# Altium schematic sheet MDL_CONTROL.SchDoc: CONCENTRADOR 2.0
size A3
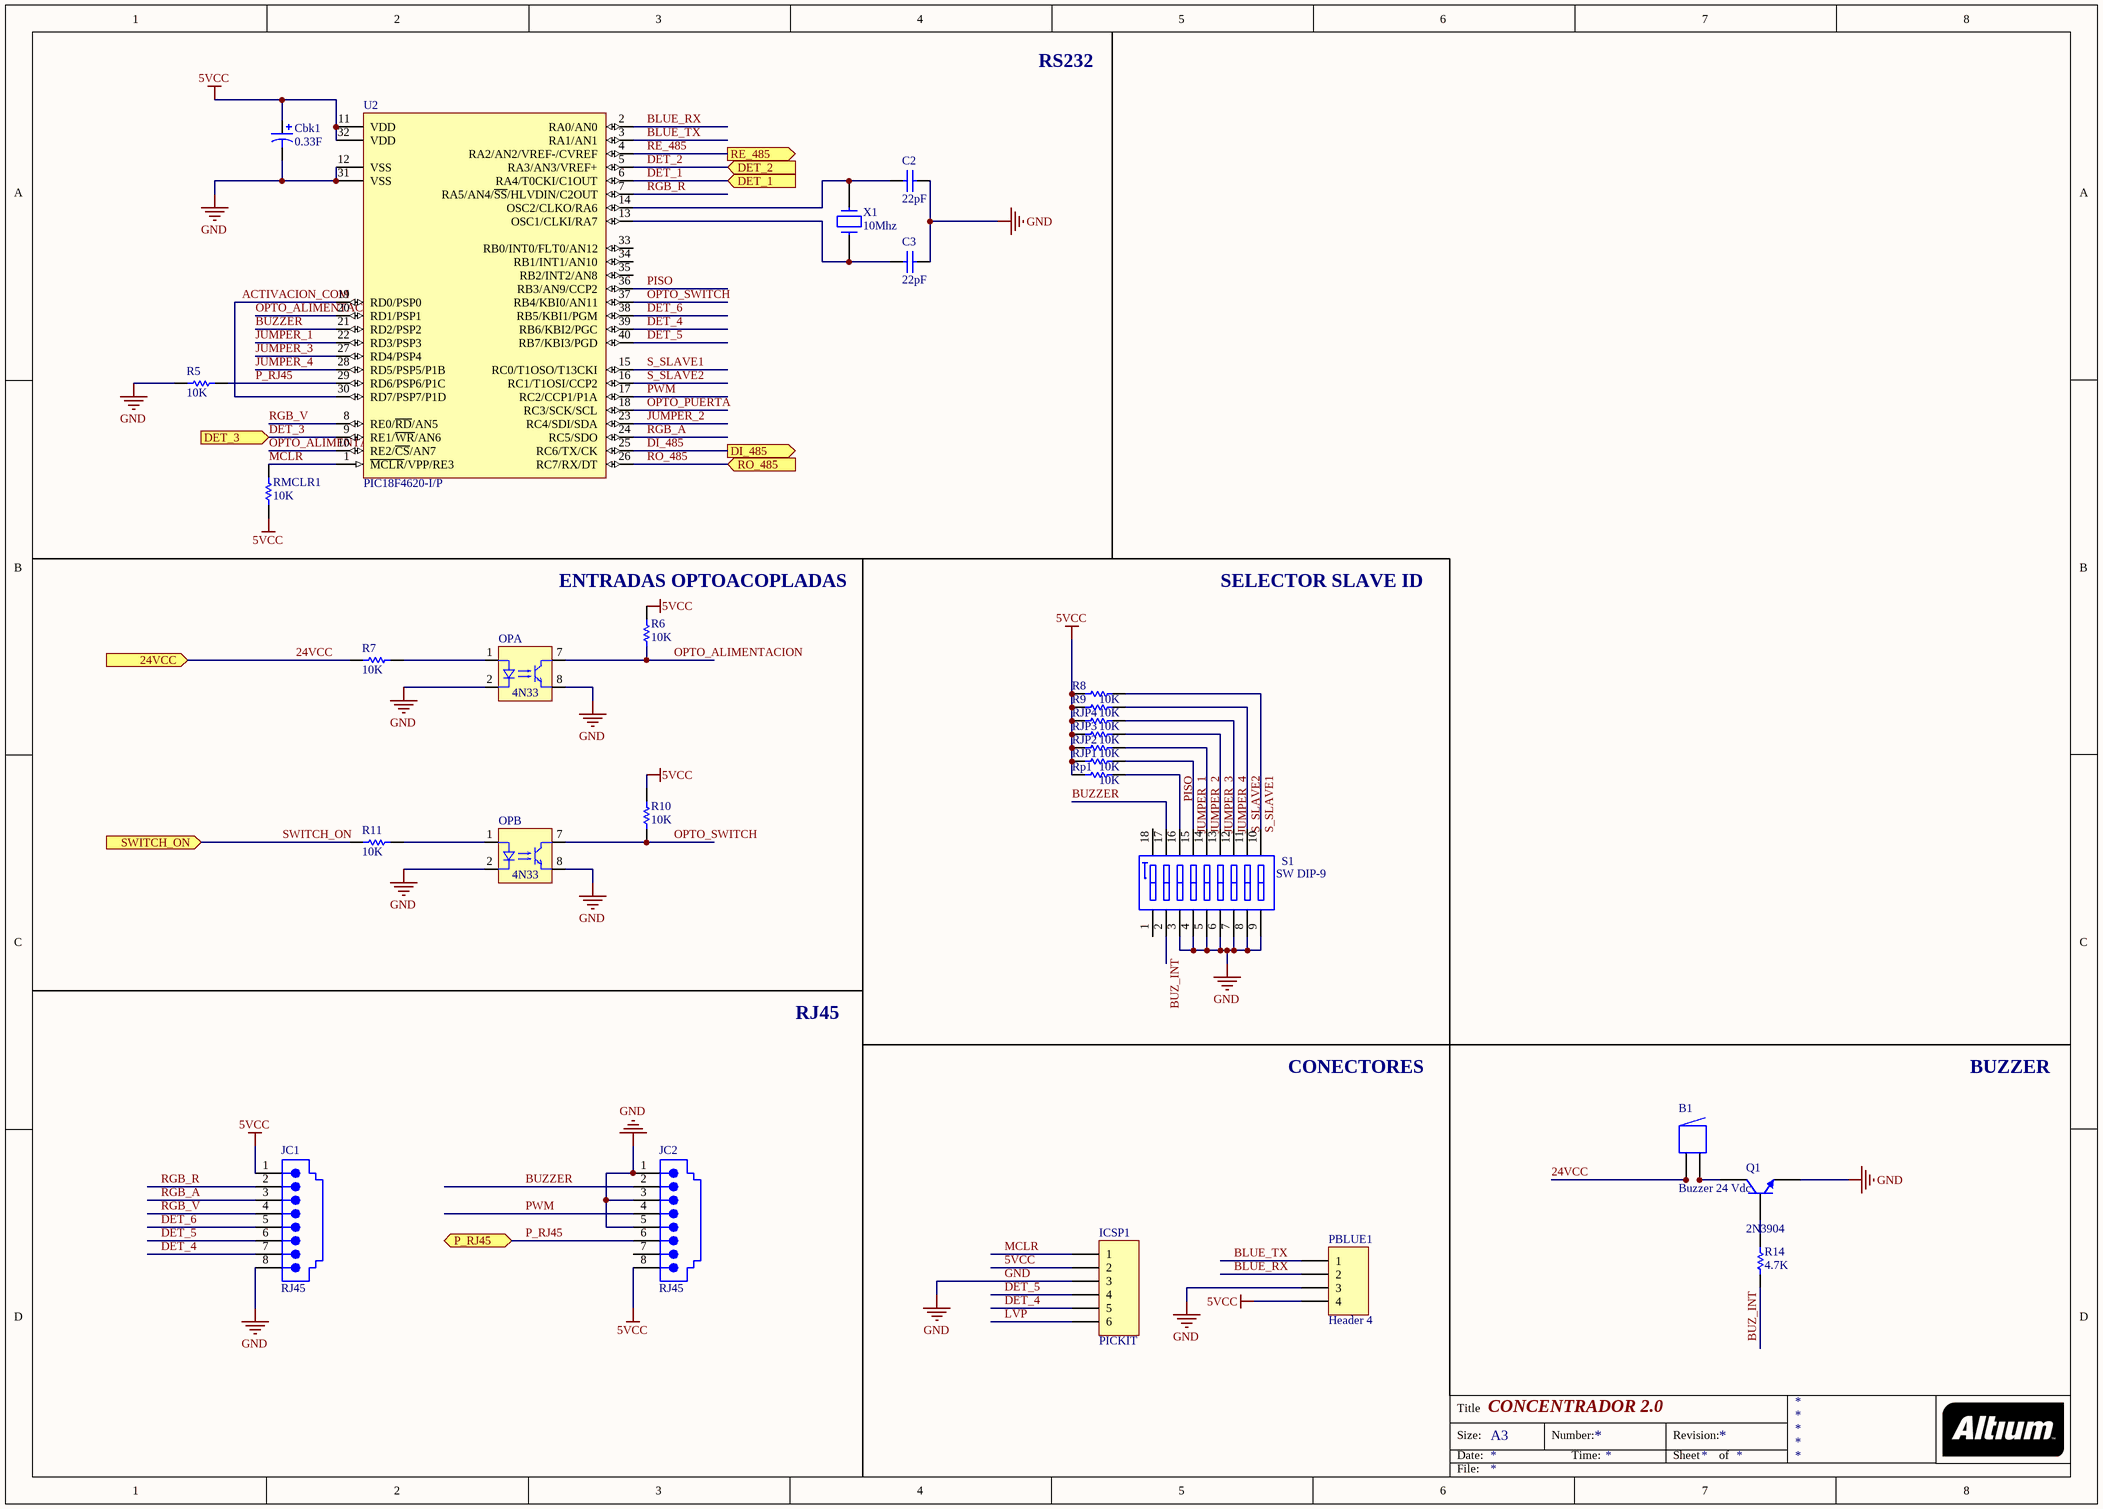
[diagram p0: MDL_CONTROL.SchDoc]

## Parts
B1  Buzzer 24 Vdc  [ABSM-1574]
C2  value 22pF  [VP31-2.5]  (hidden comment: VP31BA220JB)
C3  value 22pF  [VP31-2.5]  (hidden comment: VP31BA220JB)
Cbk1  value 0.33F  [C1000UF]  (hidden comment: Cap Pol1)
ICSP1  PICKIT  [HDR1X6]
JC1  RJ45  [15-43-6233]
JC2  RJ45  [15-43-6233]
OP  4N33  [4n35_4n33_6pines]  (parts A,B of 2)
PBLUE1  Header 4  [HDR1X4]
Q1  2N3904  [TO-92A]
R5  value 10K  [AXIAL-0.3]  (hidden comment: Res)
R6  value 10K  [AXIAL-0.3]  (hidden comment: Res)
R7  value 10K  [AXIAL-0.3]  (hidden comment: Res)
R8  value 10K  [AXIAL-0.3]  (hidden comment: Res)
R9  value 10K  [AXIAL-0.3]  (hidden comment: Res)
R10  value 10K  [AXIAL-0.3]  (hidden comment: Res)
R11  value 10K  [AXIAL-0.3]  (hidden comment: Res)
R14  value 4.7K  [AXIAL-0.3]  (hidden comment: Res)
RJP1  value 10K  [AXIAL-0.3]  (hidden comment: Res)
RJP2  value 10K  [AXIAL-0.3]  (hidden comment: Res)
RJP3  value 10K  [AXIAL-0.3]  (hidden comment: Res)
RJP4  value 10K  [AXIAL-0.3]  (hidden comment: Res)
RMCLR1  value 10K  [AXIAL-0.3]  (hidden comment: Res)
Rp1  value 10K  [AXIAL-0.3]  (hidden comment: Res)
S1  SW DIP-9  [DIP-18]
U2  PIC18F4620-I/P  [PDIP600-P40]
X1  10Mhz  [XTAL-1]

## Ports
24VCC (in), DET_1 (in), DET_2 (in), DET_3 (in), DI_485 (out), P_RJ45 (bidir), RE_485 (out), RO_485 (in), SWITCH_ON (in)

## Nets
5VCC: Cbk1.1 ICSP1.2 JC1.1 JC2.8 PBLUE1.4 R6.2 R8.2 R9.2 R10.2 RJP1.2 RJP2.2 RJP3.2 RJP4.2 RMCLR1.2 Rp1.2 U2.11(VDD) U2.32(VDD)
GND: C2.2 C3.1 Cbk1.2 ICSP1.3 JC1.8 JC2.1 JC2.3 JC2.5 OP.2(K) OP.8(E) PBLUE1.3 Q1.1(E) R5.2 S1.3(A3) S1.4(A4) S1.5(A5) S1.6(A6) S1.7(A7) S1.8(A8) S1.9(A9) U2.12(VSS) U2.31(VSS)
24VCC: B1.1 B1.1A R7.1 ; port 24VCC
ACTIVACION_COM: U2.19(RD0/PSP0) U2.30(RD7/PSP7/P1D)
BLUE_RX: PBLUE1.2 U2.2(RA0/AN0)
BLUE_TX: PBLUE1.1 U2.3(RA1/AN1)
BUZ_INT: R14.1 S1.2(A2)
BUZZER: JC2.2 S1.17(B2) U2.21(RD2/PSP2)
DET_1: U2.6(RA4/T0CKI/C1OUT) ; port DET_1
DET_2: U2.5(RA3/AN3/VREF+) ; port DET_2
DET_3: U2.9(RE1/~{WR}/AN6) ; port DET_3
DET_4: ICSP1.5 JC1.7 U2.39(RB6/KBI2/PGC)
DET_5: ICSP1.4 JC1.6 U2.40(RB7/KBI3/PGD)
DET_6: JC1.5 U2.38(RB5/KBI1/PGM)
DI_485: U2.25(RC6/TX/CK) ; port DI_485
JUMPER_1: RJP1.1 S1.15(B4) U2.22(RD3/PSP3)
JUMPER_2: RJP2.1 S1.14(B5) U2.23(RC4/SDI/SDA)
JUMPER_3: RJP3.1 S1.13(B6) U2.27(RD4/PSP4)
JUMPER_4: RJP4.1 S1.12(B7) U2.28(RD5/PSP5/P1B)
LVP: ICSP1.6
MCLR: ICSP1.1 RMCLR1.1 U2.1(~{MCLR}/VPP/RE3)
OPTO_ALIMENTACION: OP.7(C) R6.1 U2.10(RE2/~{CS}/AN7) U2.20(RD1/PSP1)
OPTO_PUERTA: U2.18(RC3/SCK/SCL)
OPTO_SWITCH: OP.7(C) R10.1 U2.37(RB4/KBI0/AN11)
P_RJ45: JC2.6 R5.1 U2.29(RD6/PSP6/P1C) ; port P_RJ45
PISO: Rp1.1 S1.16(B3) U2.36(RB3/AN9/CCP2)
PWM: JC2.4 U2.17(RC2/CCP1/P1A)
RE_485: U2.4(RA2/AN2/VREF-/CVREF) ; port RE_485
RGB_A: JC1.3 U2.24(RC5/SDO)
RGB_R: JC1.2 U2.7(RA5/AN4/~{SS}/HLVDIN/C2OUT)
RGB_V: JC1.4 U2.8(RE0/~{RD}/AN5)
RO_485: U2.26(RC7/RX/DT) ; port RO_485
S_SLAVE1: R8.1 S1.10(B9) U2.15(RC0/T1OSO/T13CKI)
S_SLAVE2: R9.1 S1.11(B8) U2.16(RC1/T1OSI/CCP2)
SWITCH_ON: R11.1 ; port SWITCH_ON
NetB1_2: B1.2 B1.2A Q1.3(C)
NetC2_1: C2.1 U2.14(OSC2/CLKO/RA6) X1.1
NetC3_2: C3.2 U2.13(OSC1/CLKI/RA7) X1.2
NetOP_1: OP.1(A) R7.2
NetOP_1: OP.1(A) R11.2  [a separate net that carries the same name]
NetQ1_2: Q1.2(B) R14.2

Not connected (* = marked no-connect by the designer): JC2 7; S1 1(A1) 18(B1); U2 33(RB0/INT0/FLT0/AN12) 34(RB1/INT1/AN10) 35(RB2/INT2/AN8)

## Notes on the sheet
- RS232
- (near R6) ENTRADAS OPTOACOPLADAS
- SELECTOR SLAVE ID
- RJ45
- CONECTORES
- BUZZER
- Title
- Size:
- Date:
- A3
- Number:
- Time:
- Revision:
- Sheet
- of
- File:

## Library data of the parts
B1 = Buzzer: Magnetic Transducer Buzzer; Published: 24-Mar-1999; LatestRevisionDate: 17-Dec-2003; LatestRevisionNote: Schematic revised, PCB Footprint replaced.; DatasheetVersion: 17-Dec-2003; PackageReference: ABSM-1574; Publisher: Altium Limited; PackageDescription: Magnetic Transducer Buzzer; ComponentLink1Description: Manufacturer Link; ComponentLink1URL: http://www.megastar.com/linecard/buzzmode/index.php
C2 C3 = VP31BA220JB: Dipped Radial Multilayer Ceramic Capacitor COG (NPO): 22pF, 100V; Note: See Datasheet for other packages & tolerances; Published: 17-Dec-2003; DatasheetDocument: 2-Jan-2002; PackageDocument: 8-Feb-2002; PackageReference: VP31-2.5; Publisher: Altium Limited; ComponentLink1Description: Manufacturer Link; ComponentLink1URL: http://www.vishay.com/
Cbk1 = Cap Pol1: Polarized Capacitor (Radial); Published: 8-Jun-2000; LatestRevisionDate: 17-Jul-2002; LatestRevisionNote: Re-released for DXP Platform.; PackageReference: RB7.6-15; Publisher: Altium Limited
ICSP1 = Header 6: Header, 6-Pin; LatestRevisionDate: 17-Jul-2002; LatestRevisionNote: Re-released for DXP Platform.; Publisher: Altium Limited
JC1 JC2 = 15-43-6233: Right Angle, Standard Profile, RJ45-Keyed, Flange Mount PCB Jack; Ports: 1; Positions/Loaded: Port1 - 8 Keyed/8; PerformanceCategory: 3; PCB_Mounting: Thru-Hole; ComponentAvailability: Obsolete; DrillSize: Nominal, Rounded to nearest 0.05mm; PCB_Layout: Complies with Manufacturer's Recommendation.; Published: 25-Jun-2002; DatasheetDocument: 18-Dec-2001; PackageDocument: 18-Dec-2001; PackageReference: 15-43-6233; Publisher: Altium Limited; ComponentLink1Description: Manufacturer Link; ComponentLink1URL: http://www.molex.com/; ComponentLink2Description: Datasheet; ComponentLink2URL: http://www.molex.com/cmc_upload/common_files/1212003_catalogmx41314.pdf; ComponentLink3Description: Iges Model; ComponentLink3URL: http://www.molex.com/pdm_docs/igs/15-43-6233_igs.zip
OP = ILD74: Optocoupler, Phototransistor Output, Dual Channel, TTL Compatible, Pb-free; Note: Coupling Capacitance, 0.5 pF; Note: Transfer Ratio, 35 % Typical; Published: 6-Oct-2005; DatasheetDocument: Rev. 1.4, Oct-2004; PackageDocument: Dec-2003; PackageReference: DIP8; Publisher: Altium Limited; ComponentLink1Description: Manufacturer Link; ComponentLink1URL: http://www.vishay.com/optocouplers/list/product-83640/; ComponentLink2Description: Datasheet; ComponentLink2URL: http://www.vishay.com/docs/83640/83640.pdf
PBLUE1 = Header 4: Header, 4-Pin; LatestRevisionDate: 17-Jul-2002; LatestRevisionNote: Re-released for DXP Platform.; Publisher: Altium Limited
Q1 = 2N3904: NPN General Purpose Amplifier; Published: 8-Jun-2000; LatestRevisionDate: 15-Jan-2003; LatestRevisionNote: PCB Footprint 'BCY-W3/D4.7' replaced; DatasheetVersion: 1997; PackageVersion: Sep-1998; PackageReference: TO-92A; Publisher: Altium Limited; PackageDescription: TO, Flat Index; 3 In-Line, Axial Leads; Body Dia. 4.5mm; Leads 0.51 x 0.48 mm (max); ComponentLink1Description: Manufacturer Link; ComponentLink1URL: http://www.fairchildsemi.com/; ComponentLink2Description: Datasheet; ComponentLink2URL: http://www.fairchildsemi.com/ds/2N%2F2N3904.pdf
R5-R11 R14 RJP1-RJP4 RMCLR1 Rp1 = Res1: Resistor; Published: 8-Jun-2000; LatestRevisionDate: 17-Jul-2002; LatestRevisionNote: Re-released for DXP Platform.; PackageReference: AXIAL-0.3; Publisher: Altium Limited
S1 = SW DIP-9: DIP Switch, 9 Position, SPST; Published: 24-Mar-1999; LatestRevisionDate: 17-Jul-2002; LatestRevisionNote: Re-released for DXP Platform.; PackageReference: DIP-18; Publisher: Altium Limited; Code_JEDEC: MO-036-AE
U2 = PIC18F4620-I/P: Enhanced Flash Microcontroller with 10-Bit A/D and nanoWatt Technology, 64K Flash, 40-Pin PDIP, Industrial Temperature Range; Manufacturer: Microchip; DatasheetVersion: revE, May-2008; PackageVersion: revBB, Aug-2009; PackageReference: PDIP600-P40; PackageDescription: 40-Lead Plastic Dual In-Line (P) - 600 mil Body [PDIP]; PartNumber: PIC18F4620-I/P; ComponentLink1Description: Manufacturer URL; ComponentLink1URL: http://www.microchip.com/; ComponentLink2Description: Datasheet; ComponentLink2URL: http://ww1.microchip.com/downloads/en/DeviceDoc/39626e.pdf; ComponentLink3Description: Package Specification; ComponentLink3URL: http://www.microchip.com/stellent/groups/techpub_sg/documents/packagingspec/en012702.pdf
X1 = Cristal de cuarzo: X1: 10Mhz